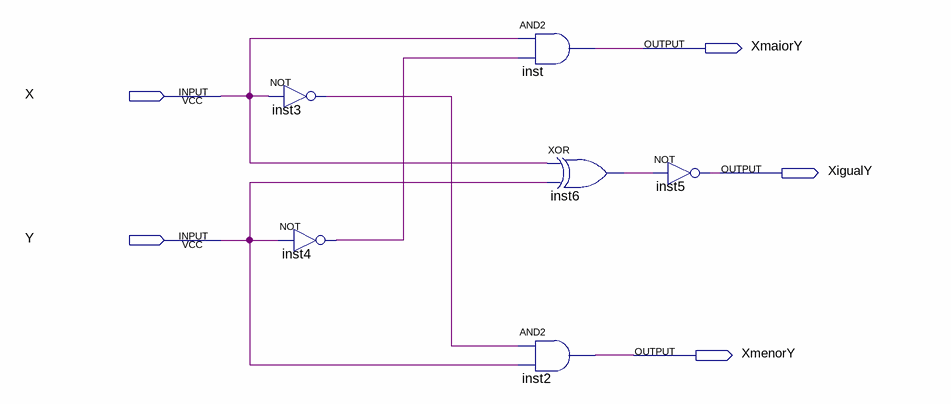
[diagram p0: schematic sheet]
// Quartus schematic lab4-2.bdf as structural Verilog: 6 symbols, 5 pins
module \lab4-2  (
  input  X,
  input  Y,
  output XmaiorY,
  output XigualY,
  output XmenorY
);

  wire inst3_out, inst4_out, inst6_out;

  not inst3 (inst3_out, X);
  not inst4 (inst4_out, Y);
  and inst (XmaiorY, X, inst4_out);
  xor inst6 (inst6_out, X, Y);
  and inst2 (XmenorY, inst3_out, Y);
  not inst5 (XigualY, inst6_out);
endmodule
